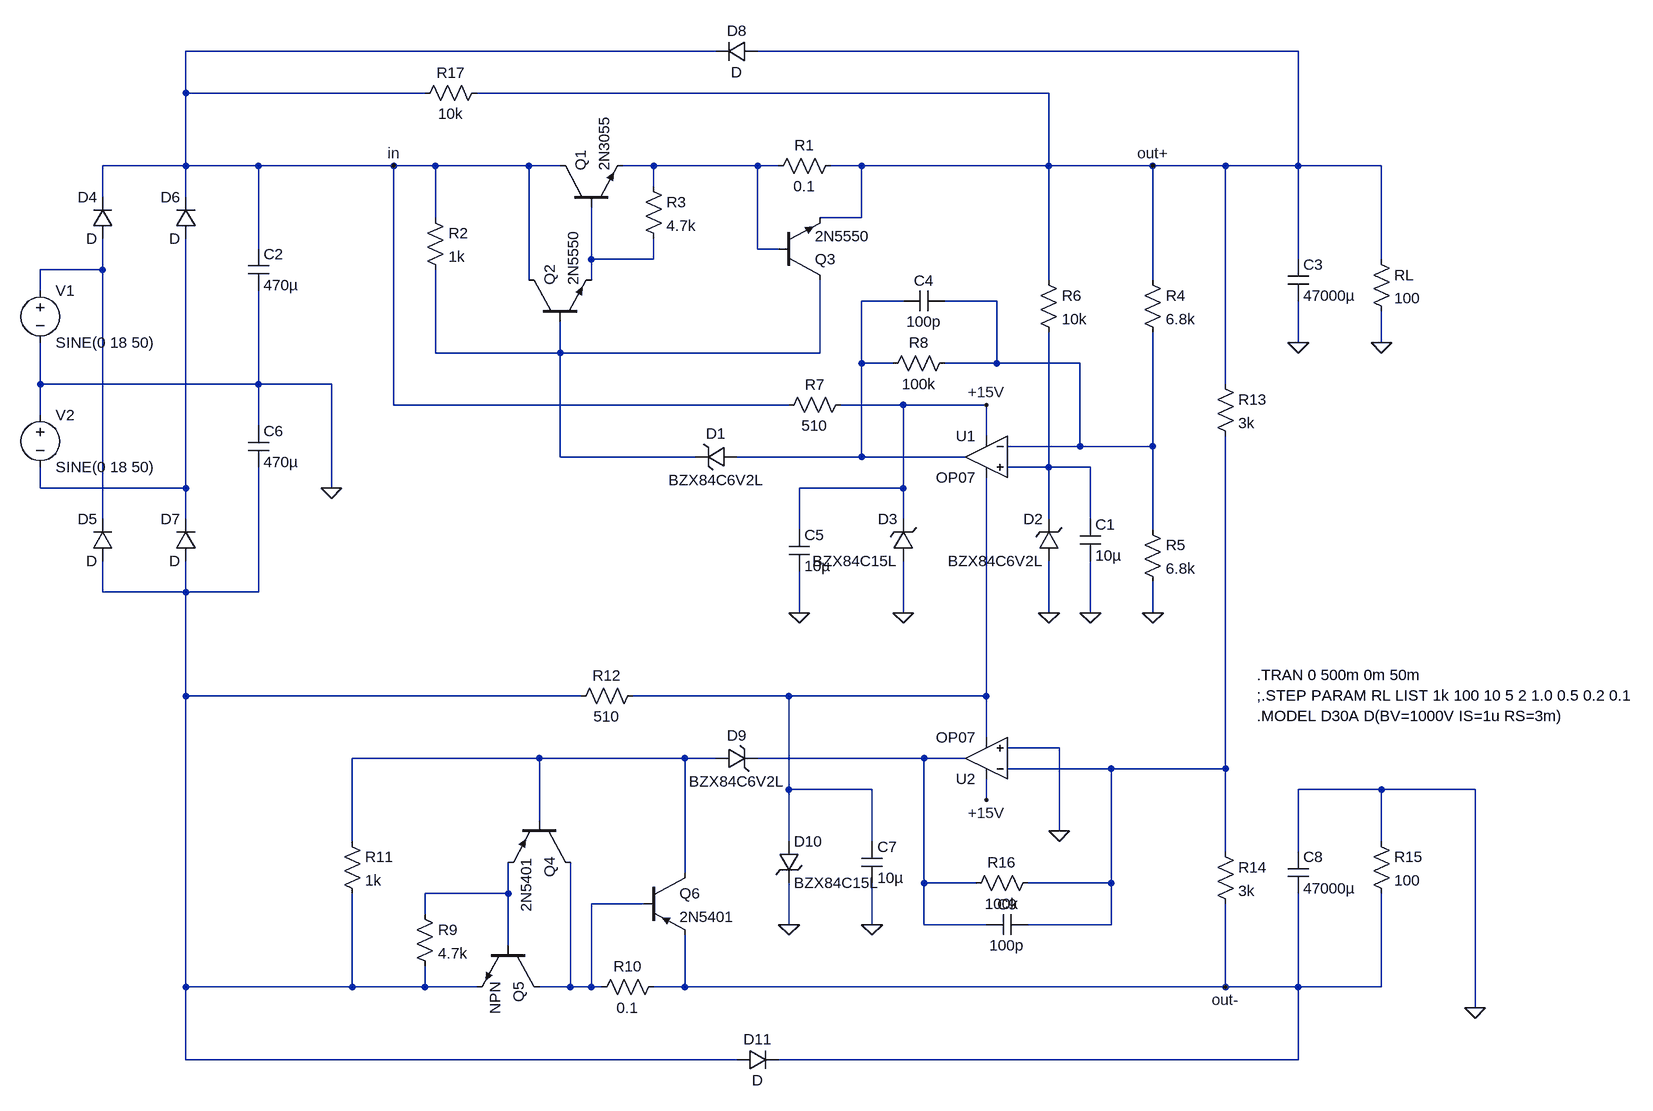
[diagram p0: schematic Regulator.asc]
Regulator.asc, the LTspice schematic file:
Version 4
SHEET 1 1752 1468
WIRE 96 -272 -720 -272
WIRE 992 -272 160 -272
WIRE -720 -208 -720 -272
WIRE -352 -208 -720 -208
WIRE 608 -208 -272 -208
WIRE -720 -96 -720 -208
WIRE -720 -96 -848 -96
WIRE -608 -96 -720 -96
WIRE -400 -96 -608 -96
WIRE -336 -96 -400 -96
WIRE -192 -96 -336 -96
WIRE -144 -96 -192 -96
WIRE 0 -96 -48 -96
WIRE 160 -96 0 -96
WIRE 192 -96 160 -96
WIRE 320 -96 272 -96
WIRE 608 -96 608 -208
WIRE 608 -96 320 -96
WIRE 768 -96 608 -96
WIRE 880 -96 768 -96
WIRE 992 -96 992 -272
WIRE 992 -96 880 -96
WIRE 1120 -96 992 -96
WIRE 0 -64 0 -96
WIRE -848 -48 -848 -96
WIRE -720 -48 -720 -96
WIRE -336 -16 -336 -96
WIRE 320 -16 320 -96
WIRE 320 -16 256 -16
WIRE -608 32 -608 -96
WIRE 160 32 160 -96
WIRE 192 32 160 32
WIRE -96 48 -96 -32
WIRE 0 48 0 16
WIRE 0 48 -96 48
WIRE 992 48 992 -96
WIRE 1120 48 1120 -96
WIRE -848 64 -848 16
WIRE -848 64 -944 64
WIRE -192 80 -192 -96
WIRE -96 80 -96 48
WIRE 608 80 608 -96
WIRE 768 80 768 -96
WIRE -944 96 -944 64
WIRE 384 112 320 112
WIRE 528 112 448 112
WIRE 992 176 992 112
WIRE 1120 176 1120 128
WIRE -336 192 -336 64
WIRE -144 192 -144 144
WIRE -144 192 -336 192
WIRE 256 192 256 80
WIRE 256 192 -144 192
WIRE 320 208 320 112
WIRE 368 208 320 208
WIRE 528 208 528 112
WIRE 528 208 448 208
WIRE 656 208 528 208
WIRE -944 240 -944 176
WIRE -608 240 -608 96
WIRE -608 240 -944 240
WIRE -496 240 -608 240
WIRE 880 240 880 -96
WIRE -400 272 -400 -96
WIRE 208 272 -400 272
WIRE 384 272 288 272
WIRE 512 272 384 272
WIRE -944 288 -944 240
WIRE -608 304 -608 240
WIRE 512 320 512 272
WIRE 656 336 656 208
WIRE 656 336 544 336
WIRE 768 336 768 160
WIRE 768 336 656 336
WIRE -144 352 -144 192
WIRE 64 352 -144 352
WIRE 320 352 320 208
WIRE 320 352 128 352
WIRE 480 352 320 352
WIRE 608 368 608 160
WIRE 608 368 544 368
WIRE 672 368 608 368
WIRE -944 400 -944 368
WIRE -720 400 -720 16
WIRE -720 400 -944 400
WIRE -496 400 -496 240
WIRE 384 400 384 272
WIRE 384 400 224 400
WIRE -848 448 -848 64
WIRE -720 448 -720 400
WIRE 384 448 384 400
WIRE 608 448 608 368
WIRE 672 448 672 368
WIRE 224 464 224 400
WIRE 768 464 768 336
WIRE -848 560 -848 512
WIRE -720 560 -720 512
WIRE -720 560 -848 560
WIRE -608 560 -608 368
WIRE -608 560 -720 560
WIRE 224 592 224 528
WIRE 384 592 384 512
WIRE 608 592 608 512
WIRE 672 592 672 512
WIRE 768 592 768 544
WIRE -720 720 -720 560
WIRE -112 720 -720 720
WIRE 208 720 -32 720
WIRE 512 720 512 384
WIRE 512 720 208 720
WIRE 512 784 512 720
WIRE 624 800 544 800
WIRE -176 816 -464 816
WIRE 48 816 -176 816
WIRE 96 816 48 816
WIRE 416 816 160 816
WIRE 480 816 416 816
WIRE 704 832 544 832
WIRE 880 832 880 320
WIRE 880 832 704 832
WIRE 208 864 208 720
WIRE 336 864 208 864
WIRE 1120 864 992 864
WIRE 1264 864 1120 864
WIRE 512 880 512 848
WIRE -176 912 -176 816
WIRE 624 928 624 800
WIRE -464 944 -464 816
WIRE 208 944 208 864
WIRE 336 944 336 864
WIRE 1120 944 1120 864
WIRE 880 960 880 832
WIRE 992 960 992 864
WIRE 48 992 48 816
WIRE 416 1008 416 816
WIRE 496 1008 416 1008
WIRE 704 1008 704 832
WIRE 704 1008 576 1008
WIRE -224 1024 -224 976
WIRE -224 1024 -352 1024
WIRE -16 1040 -96 1040
WIRE -352 1056 -352 1024
WIRE 208 1072 208 1008
WIRE 336 1072 336 1008
WIRE 416 1072 416 1008
WIRE 512 1072 416 1072
WIRE 704 1072 704 1008
WIRE 704 1072 576 1072
WIRE -224 1104 -224 1024
WIRE -720 1168 -720 720
WIRE -464 1168 -464 1024
WIRE -464 1168 -720 1168
WIRE -352 1168 -352 1136
WIRE -352 1168 -464 1168
WIRE -272 1168 -352 1168
WIRE -128 1168 -128 976
WIRE -128 1168 -176 1168
WIRE -96 1168 -96 1040
WIRE -96 1168 -128 1168
WIRE -80 1168 -96 1168
WIRE 48 1168 48 1088
WIRE 48 1168 0 1168
WIRE 880 1168 880 1040
WIRE 880 1168 48 1168
WIRE 992 1168 992 1024
WIRE 992 1168 880 1168
WIRE 1120 1168 1120 1024
WIRE 1120 1168 992 1168
WIRE 1264 1200 1264 864
WIRE -720 1280 -720 1168
WIRE 128 1280 -720 1280
WIRE 992 1280 992 1168
WIRE 992 1280 192 1280
FLAG 608 592 0
FLAG 768 592 0
FLAG 384 592 0
FLAG 1120 176 0
FLAG 768 -96 out+
FLAG 672 592 0
FLAG -400 -96 in
FLAG 992 176 0
FLAG 224 592 0
FLAG -496 400 0
FLAG 512 272 +15V
FLAG 512 880 +15V
FLAG 208 1072 0
FLAG 624 928 0
FLAG 336 1072 0
FLAG 1264 1200 0
FLAG 880 1168 out-
SYMBOL Opamps\\OP07 512 288 M0
SYMATTR InstName U1
SYMBOL npn -144 -32 R270
SYMATTR InstName Q1
SYMATTR Value 2N3055
SYMBOL npn -192 144 R270
SYMATTR InstName Q2
SYMATTR Value 2N5550
SYMBOL res 288 -112 R90
WINDOW 0 0 56 VBottom 2
WINDOW 3 32 56 VTop 2
SYMATTR InstName R1
SYMATTR Value 0.1
SYMATTR SpiceLine tol=5 pwr=10
SYMBOL res -352 -32 R0
SYMATTR InstName R2
SYMATTR Value 1k
SYMATTR SpiceLine tol=5 pwr=0.625
SYMBOL zener 128 336 R90
WINDOW 0 -4 32 VBottom 2
WINDOW 3 36 32 VTop 2
SYMATTR InstName D1
SYMATTR Value BZX84C6V2L
SYMBOL res -16 -80 R0
SYMATTR InstName R3
SYMATTR Value 4.7k
SYMATTR SpiceLine tol=6 pwr=0.625
SYMBOL res 752 64 R0
SYMATTR InstName R4
SYMATTR Value 6.8k
SYMATTR SpiceLine tol=1 pwr=1
SYMBOL res 752 448 R0
SYMATTR InstName R5
SYMATTR Value 6.8k
SYMATTR SpiceLine tol=1 pwr=1
SYMBOL zener 624 512 R180
WINDOW 0 24 64 Left 2
WINDOW 3 24 0 Left 2
SYMATTR InstName D2
SYMATTR Value BZX84C6V2L
SYMBOL res 592 64 R0
SYMATTR InstName R6
SYMATTR Value 10k
SYMATTR SpiceLine tol=5 pwr=0.625
SYMBOL res 304 256 R90
WINDOW 0 0 56 VBottom 2
WINDOW 3 32 56 VTop 2
SYMATTR InstName R7
SYMATTR Value 510
SYMATTR SpiceLine tol=5 pwr=0.625
SYMBOL zener 400 512 R180
WINDOW 0 24 64 Left 2
WINDOW 3 24 0 Left 2
SYMATTR InstName D3
SYMATTR Value BZX84C15L
SYMBOL res 1104 32 R0
SYMATTR InstName RL
SYMATTR Value 100
SYMBOL npn 192 80 M180
SYMATTR InstName Q3
SYMATTR Value 2N5550
SYMBOL cap 656 448 R0
SYMATTR InstName C1
SYMATTR Value 10µ
SYMBOL voltage -944 80 R0
WINDOW 123 0 0 Left 2
WINDOW 39 24 124 Left 2
SYMATTR InstName V1
SYMATTR Value SINE(0 18 50)
SYMBOL diode -832 16 R180
WINDOW 0 24 64 Left 2
WINDOW 3 24 0 Left 2
SYMATTR InstName D4
SYMBOL diode -832 512 R180
WINDOW 0 24 64 Left 2
WINDOW 3 24 0 Left 2
SYMATTR InstName D5
SYMBOL diode -704 16 R180
WINDOW 0 24 64 Left 2
WINDOW 3 24 0 Left 2
SYMATTR InstName D6
SYMBOL diode -704 512 R180
WINDOW 0 24 64 Left 2
WINDOW 3 24 0 Left 2
SYMATTR InstName D7
SYMBOL cap -624 32 R0
SYMATTR InstName C2
SYMATTR Value 470µ
SYMBOL cap 976 48 R0
SYMATTR InstName C3
SYMATTR Value 47000µ
SYMBOL res 464 192 R90
WINDOW 0 0 56 VBottom 2
WINDOW 3 32 56 VTop 2
SYMATTR InstName R8
SYMATTR Value 100k
SYMBOL cap 208 464 R0
SYMATTR InstName C5
SYMATTR Value 10µ
SYMBOL cap 448 96 R90
WINDOW 0 0 32 VBottom 2
WINDOW 3 32 32 VTop 2
SYMATTR InstName C4
SYMATTR Value 100p
SYMBOL diode 160 -288 R90
WINDOW 0 0 32 VBottom 2
WINDOW 3 32 32 VTop 2
SYMATTR InstName D8
SYMBOL Opamps\\OP07 512 880 R180
SYMATTR InstName U2
SYMBOL voltage -944 272 R0
WINDOW 123 0 0 Left 2
WINDOW 39 0 0 Left 2
SYMATTR InstName V2
SYMATTR Value SINE(0 18 50)
SYMBOL pnp -128 912 R90
SYMATTR InstName Q4
SYMATTR Value 2N5401
SYMBOL res -368 1040 R0
SYMATTR InstName R9
SYMATTR Value 4.7k
SYMATTR SpiceLine tol=5 pwr=0.625
SYMBOL res 16 1152 R90
WINDOW 0 0 56 VBottom 2
WINDOW 3 32 56 VTop 2
SYMATTR InstName R10
SYMATTR Value 0.1
SYMATTR SpiceLine tol=5 pwr=10
SYMBOL zener 96 832 R270
WINDOW 0 36 32 VTop 2
WINDOW 3 -4 32 VBottom 2
SYMATTR InstName D9
SYMATTR Value BZX84C6V2L
SYMBOL pnp -16 992 R0
SYMATTR InstName Q6
SYMATTR Value 2N5401
SYMBOL res -480 928 R0
SYMATTR InstName R11
SYMATTR Value 1k
SYMATTR SpiceLine tol=5 pwr=0.625
SYMBOL cap -624 304 R0
SYMATTR InstName C6
SYMATTR Value 470µ
SYMBOL res -16 704 R90
WINDOW 0 0 56 VBottom 2
WINDOW 3 32 56 VTop 2
SYMATTR InstName R12
SYMATTR Value 510
SYMATTR SpiceLine tol=5 pwr=0.625
SYMBOL zener 192 944 R0
SYMATTR InstName D10
SYMATTR Value BZX84C15L
SYMBOL res 864 224 R0
SYMATTR InstName R13
SYMATTR Value 3k
SYMATTR SpiceLine tol=1 pwr=1
SYMBOL res 864 944 R0
SYMATTR InstName R14
SYMATTR Value 3k
SYMATTR SpiceLine tol=1 pwr=1
SYMBOL cap 320 944 R0
SYMATTR InstName C7
SYMATTR Value 10µ
SYMBOL cap 976 960 R0
SYMATTR InstName C8
SYMATTR Value 47000µ
SYMBOL res 1104 928 R0
SYMATTR InstName R15
SYMATTR Value 100
SYMBOL diode 128 1296 R270
WINDOW 0 32 32 VTop 2
WINDOW 3 0 32 VBottom 2
SYMATTR InstName D11
SYMBOL res 592 992 R90
WINDOW 0 0 56 VBottom 2
WINDOW 3 32 56 VTop 2
SYMATTR InstName R16
SYMATTR Value 100k
SYMBOL cap 576 1056 R90
WINDOW 0 0 32 VBottom 2
WINDOW 3 32 32 VTop 2
SYMATTR InstName C9
SYMATTR Value 100p
SYMBOL npn -176 1104 R90
SYMATTR InstName Q5
SYMBOL res -256 -224 R90
WINDOW 0 0 56 VBottom 2
WINDOW 3 32 56 VTop 2
SYMATTR InstName R17
SYMATTR Value 10k
TEXT 928 688 Left 2 !.TRAN 0 500m 0m 50m\n;.STEP PARAM RL LIST 1k 100 10 5 2 1.0 0.5 0.2 0.1\n.MODEL D30A D(BV=1000V IS=1u RS=3m)

The netlist it stands for:
* Regulator.asc
XU1 N007 N005 +15V N010 N004 LT1001  ; OP07, pins In+ In- V+ V- OUT
Q1 in N002 N001 0 2N3055
Q2 in N006 N002 0 2N5550
R1 out+ N001 0.1 tol=5 pwr=10
R2 in N006 1k tol=5 pwr=0.625
D1 N004 N006 BZX84C6V2L
R3 N001 N002 4.7k tol=6 pwr=0.625
R4 out+ N005 6.8k tol=1 pwr=1
R5 N005 0 6.8k tol=1 pwr=1
D2 0 N007 BZX84C6V2L
R6 out+ N007 10k tol=5 pwr=0.625
R7 +15V in 510 tol=5 pwr=0.625
D3 0 +15V BZX84C15L
RL out+ 0 100
Q3 N006 N001 out+ 0 2N5550
C1 N007 0 10µ
V1 N003 0 SINE(0 18 50)
D4 N003 in D
D5 N009 N003 D
D6 N008 in D
D7 N009 N008 D
C2 in 0 470µ
C3 out+ 0 47000µ
R8 N005 N004 100k
C5 +15V 0 10µ
C4 N005 N004 100p
D8 out+ in D
XU2 0 N013 +15V N010 N012 LT1001  ; OP07, pins In+ In- V+ V- OUT
V2 0 N008 SINE(0 18 50)
Q4 N015 N011 N014 0 2N5401
R9 N014 N009 4.7k tol=5 pwr=0.625
R10 out- N015 0.1 tol=5 pwr=10
D9 N011 N012 BZX84C6V2L
Q6 N011 N015 out- 0 2N5401
R11 N011 N009 1k tol=5 pwr=0.625
C6 0 N009 470µ
R12 N010 N009 510 tol=5 pwr=0.625
D10 N010 0 BZX84C15L
R13 out+ N013 3k tol=1 pwr=1
R14 N013 out- 3k tol=1 pwr=1
C7 N010 0 10µ
C8 0 out- 47000µ
R15 0 out- 100
D11 N009 out- D
R16 N013 N012 100k
C9 N013 N012 100p
Q5 N015 N014 N009 0 NPN
R17 out+ in 10k
.model D D
.lib standard.dio
.model NPN NPN
.model PNP PNP
.lib standard.bjt
.TRAN 0 500m 0m 50m
;.STEP PARAM RL LIST 1k 100 10 5 2 1.0 0.5 0.2 0.1
.MODEL D30A D(BV=1000V IS=1u RS=3m)
.lib LTC.lib
.backanno
.end